# Altium schematic sheet UART_CHANGER_INDICATION.SchDoc
size A4; DocumentNumber: 2; SheetNumber: 2; SheetTotal: 2
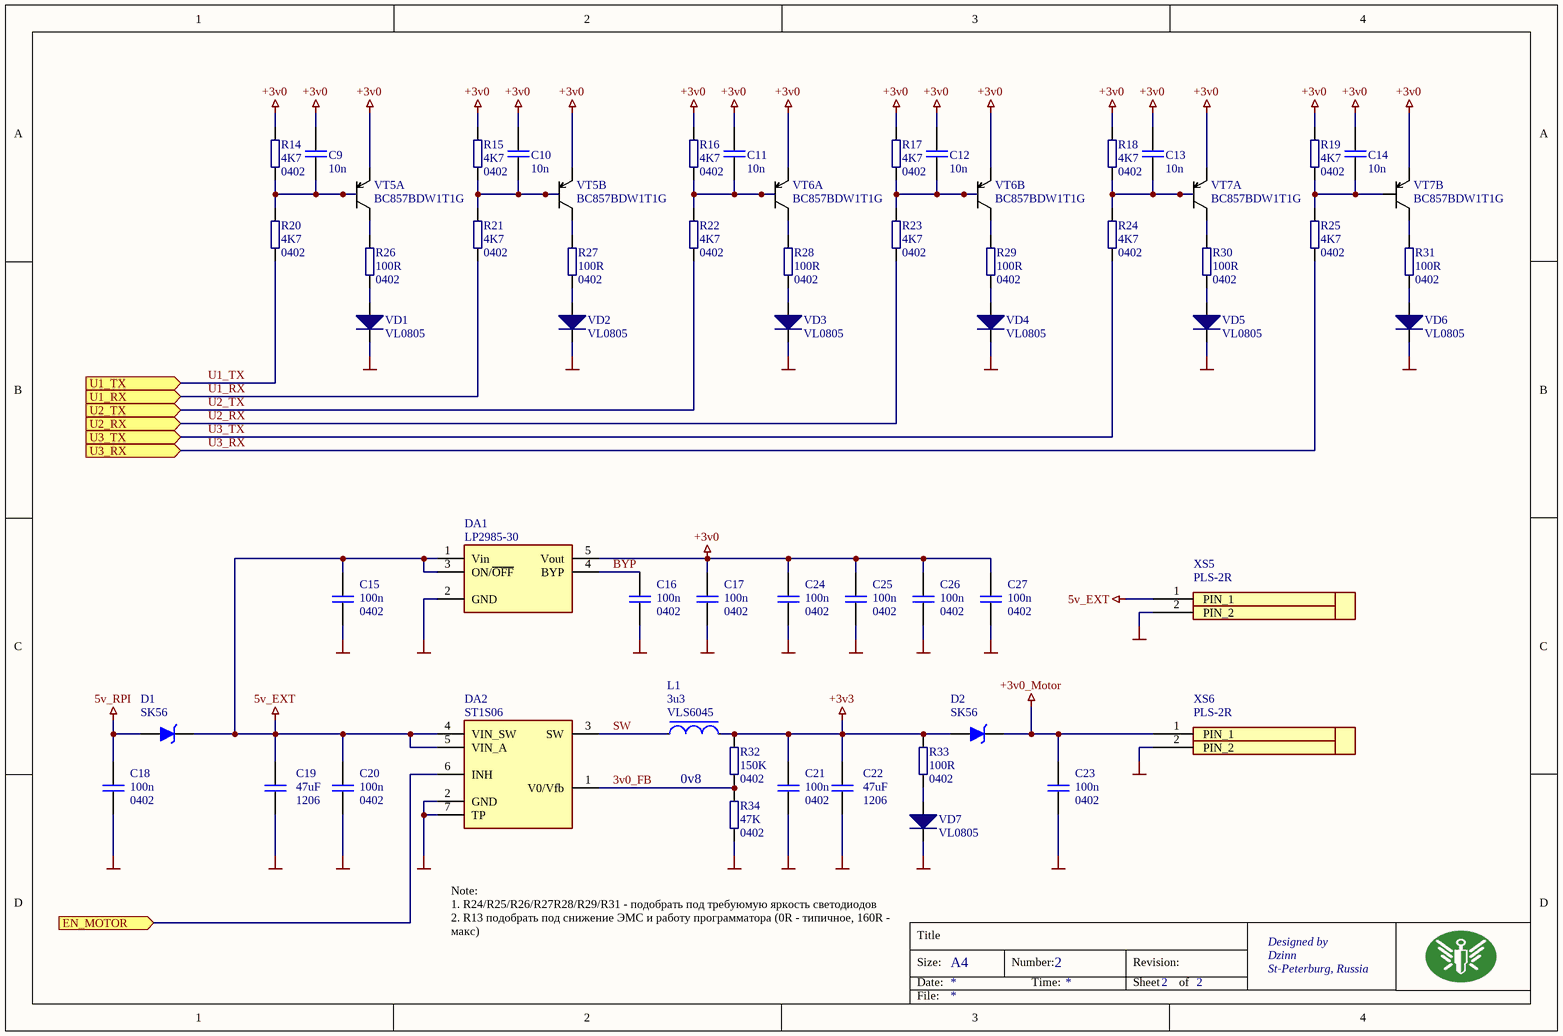
[diagram p0: UART_CHANGER_INDICATION.SchDoc]

## Parts
C9  10n  [0402]
C10  10n  [0402]
C11  10n  [0402]
C12  10n  [0402]
C13  10n  [0402]
C14  10n  [0402]
C15  100n  [0402]
C16  100n  [0402]
C17  100n  [0402]
C18  100n  [0402]
C19  47uF  [1206]
C20  100n  [0402]
C21  100n  [0402]
C22  47uF  [1206]
C23  100n  [0402]
C24  100n  [0402]
C25  100n  [0402]
C26  100n  [0402]
C27  100n  [0402]
D1  SK56  [SMB]
D2  SK56  [SMB]
DA1  LP2985-30  [SOT-23-5]
DA2  ST1S06  [DFN-6TP]
L1  3u3  [VLS6045]
R14  4K7  [0402]
R15  4K7  [0402]
R16  4K7  [0402]
R17  4K7  [0402]
R18  4K7  [0402]
R19  4K7  [0402]
R20  4K7  [0402]
R21  4K7  [0402]
R22  4K7  [0402]
R23  4K7  [0402]
R24  4K7  [0402]
R25  4K7  [0402]
R26  100R  [0402]
R27  100R  [0402]
R28  100R  [0402]
R29  100R  [0402]
R30  100R  [0402]
R31  100R  [0402]
R32  150K  [0402]
R33  100R  [0402]
R34  47K  [0402]
VD1  VL0805  [VL0805]
VD2  VL0805  [VL0805]
VD3  VL0805  [VL0805]
VD4  VL0805  [VL0805]
VD5  VL0805  [VL0805]
VD6  VL0805  [VL0805]
VD7  VL0805  [VL0805]
VT5  BC857BDW1T1G  [SOT-363]  (parts A,B of 2)
VT6  BC857BDW1T1G  [SOT-363]  (parts A,B of 2)
VT7  BC857BDW1T1G  [SOT-363]  (parts A,B of 2)
XS5  PLS-2R  [PLS-2R]
XS6  PLS-2R  [PLS-2R]

## Ports
EN_MOTOR (in), U1_RX (in), U1_TX (in), U2_RX (in), U2_TX (in), U3_RX (in), U3_TX (in)

## Nets
5v_EXT: C15.1 C19.1 C20.1 D1.2 DA1.1(Vin) DA1.3(ON/~{OFF}) DA2.4(VIN_SW) DA2.5(VIN_A) XS5.1(PIN_1)
5v_RPI: C18.1 D1.1
+3v0: C9.1 C10.1 C11.1 C12.1 C13.1 C14.1 C17.1 C24.1 C25.1 C26.1 C27.1 DA1.5(Vout) R14.2 R15.2 R16.2 R17.2 R18.2 R19.2 VT5.1 VT5.4 VT6.1 VT6.4 VT7.1 VT7.4
+3v0_Motor: C23.1 D2.2 XS6.1(PIN_1)
+3v3: C21.1 C22.1 D2.1 L1.2 R32.2 R33.2
GND: C15.2 C16.2 C17.2 C18.2 C19.2 C20.2 C21.2 C22.2 C23.2 C24.2 C25.2 C26.2 C27.2 DA1.2(GND) DA2.2(GND) DA2.7(TP) R34.1 VD1.2 VD2.2 VD3.2 VD4.2 VD5.2 VD6.2 VD7.2 XS5.2(PIN_2) XS6.2(PIN_2)
3v0_FB: DA2.1(V0/Vfb) R32.1 R34.2
BYP: C16.1 DA1.4(BYP)
EN_MOTOR: DA2.6(INH) ; port EN_MOTOR
SW: DA2.3(SW) L1.1
U1_RX: R21.1 ; port U1_RX
U1_TX: R20.1 ; port U1_TX
U2_RX: R23.1 ; port U2_RX
U2_TX: R22.1 ; port U2_TX
U3_RX: R25.1 ; port U3_RX
U3_TX: R24.1 ; port U3_TX
NetC9_2: C9.2 R14.1 R20.2 VT5.5
NetC10_2: C10.2 R15.1 R21.2 VT5.2
NetC11_2: C11.2 R16.1 R22.2 VT6.5
NetC12_2: C12.2 R17.1 R23.2 VT6.2
NetC13_2: C13.2 R18.1 R24.2 VT7.5
NetC14_2: C14.2 R19.1 R25.2 VT7.2
NetR26_1: R26.1 VD1.1
NetR26_2: R26.2 VT5.3
NetR27_1: R27.1 VD2.1
NetR27_2: R27.2 VT5.6
NetR28_1: R28.1 VD3.1
NetR28_2: R28.2 VT6.3
NetR29_1: R29.1 VD4.1
NetR29_2: R29.2 VT6.6
NetR30_1: R30.1 VD5.1
NetR30_2: R30.2 VT7.3
NetR31_1: R31.1 VD6.1
NetR31_2: R31.2 VT7.6
NetR33_1: R33.1 VD7.1

## Notes on the sheet
- 0v8
- Note:
  1. R24/R25/R26/R27R28/R29/R31 - подобрать под требуюмую яркость светодиодов
  2. R13 подобрать под снижение ЭМС и работу программатора (0R - типичное, 160R - макс)
- Title
- Size:
- Date:
- A4
- Number:
- Time:
- Revision:
- Sheet
- of
- Designed by
- Dzinn
- St-Peterburg, Russia
- File:

## Library data of the parts
C9-C14 = C000001: CAP 0402 100n; Manufacturer: Murata; Check Footprint: A; Tolerance: ±1%; Voltage: 100V; Part Number: C000001; Check Symbol: A; Value: 10n; Operating Temperature: -55°C ~ 155°C; Package: 0
C15-C18 C20 C21 C23-C27 = C000001: CAP 0402 100n; Manufacturer: Murata; Check Footprint: A; Tolerance: ±1%; Voltage: 10V; Part Number: C000001; Check Symbol: A; Value: 100n; Operating Temperature: -55°C ~ 155°C; Package: 0402
C19 C22 = C000003: CAP 1206 47uF 10V; Manufacturer: Murata; Check Footprint: A; Tolerance: ±1%; Package: 1206; Part Number: C000003; Check Symbol: A; Value: 47uF; Voltage: 10V; Operating Temperature: -55°C ~ 155°C
D1 D2 = VD00002: 60V 5A Schottky Diode; Manufacturer: SMC; Check Footprint: A; Part Number: VD00002; Check Symbol: A; Value: SK56; Operating Temperature: -50°C ~ 150°C; Package: SMB
DA1 = U00007: 150-mA Low-noise Low-dropout Regulator With Shutdown; Part Number: U00007; Manufacturer: TI; Check Footprint: B; Check Symbol: B; HelpURL: https://static.chipdip.ru/lib/170/DOC001170968.pdf; Value: LP2985-30; Operating Temperature: -40°C ~ 125°C; Package: SOT-23-5
DA2 = U00027: Synchronous rectification with inhibit, 1.5 A, 1.5 MHz fixed or / adjustable, step-down switching regulator; Part Number: U00027; Manufacturer: ST; Check Footprint: A; Check Symbol: A; Value: ST1S06; Operating Temperature: -30°C ~ 125°C; Package: DFN-6
L1 = IND000010: 3u3H smd power induction; Manufacturer: TDK; Manufacturer Part Number: VLS6045EX-3R3N; Check Footprint: A; Part Number: IND000010; Check Symbol: A; HelpURL: https://product.tdk.com/info/en/catalog/datasheets/inductor_commercial_power_vls6045ex_en.pdf; Value: 3u3; Operating Temperature: -40°C ~ 105°C; Package: VLS6045
R14-R25 = R000090: RES SMD; Manufacturer: Rohm Semiconductor; Check Footprint: A; Tolerance: ±1%; Power: 0.063W; Temperature Coefficient: ±200ppm/°C; Part Number: R000090; Check Symbol: A; HelpURL: http://rohmfs.rohm.com/en/products/databook/datasheet/passive/resistor/chip_resistor/esr.pdf; Value: 4K7; Operating Temperature: -55°C ~ 155°C; Package: 0402
R26-R31 R33 = R000050: RES SMD; Manufacturer: Rohm Semiconductor; Check Footprint: A; Tolerance: ±1%; Power: 0.063W; Temperature Coefficient: ±200ppm/°C; Part Number: R000050; Check Symbol: A; HelpURL: http://rohmfs.rohm.com/en/products/databook/datasheet/passive/resistor/chip_resistor/esr.pdf; Value: 100R; Operating Temperature: -55°C ~ 155°C; Package: 0402
R32 = R000126: RES SMD; Manufacturer: Rohm Semiconductor; Check Footprint: A; Tolerance: ±1%; Power: 0.063W; Temperature Coefficient: ±200ppm/°C; Part Number: R000126; Check Symbol: A; HelpURL: http://rohmfs.rohm.com/en/products/databook/datasheet/passive/resistor/chip_resistor/esr.pdf; Value: 150K; Operating Temperature: -55°C ~ 155°C; Package: 0402
R34 = R000114: RES SMD; Manufacturer: Rohm Semiconductor; Check Footprint: A; Tolerance: ±1%; Power: 0.063W; Temperature Coefficient: ±200ppm/°C; Part Number: R000114; Check Symbol: A; HelpURL: http://rohmfs.rohm.com/en/products/databook/datasheet/passive/resistor/chip_resistor/esr.pdf; Value: 47K; Operating Temperature: -55°C ~ 155°C; Package: 0402
VD1-VD7 = LED000002: SMD LED 0805; Check Footprint: A; Color: BLUE; Voltage: 3,2; Part Number: LED000002; Check Symbol: A; Value: VL0805; Operating Temperature: -40°C ~ 85°C; Package: O805
VT5-VT7 = VT00009: 45V 100mA Dual PNP Transistor; Manufacturer: ON; Check Footprint: A; Power: 0,380W; Part Number: VT00009; Check Symbol: A; HelpURL: https://www.onsemi.com/pub/Collateral/BC856BDW1T1-D.PDF; Value: BC857BDW1T1G; Operating Temperature: -55°C ~ 150°C; Package: SOT-363
XS5 XS6 = XS00002: 2 PIN PLS right angle; Manufacturer: TE; Check Footprint: A; Part Number: XS00002; Check Symbol: A; Value: PLS-2R; Package: PLS